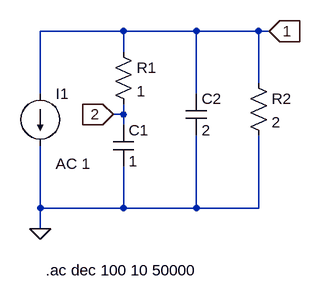
[diagram p0: schematic Lipshitz_c.asc]
Lipshitz_c.asc, the LTspice schematic file:
Version 4
SHEET 1 880 680
WIRE 32 -16 -96 -16
WIRE 144 -16 32 -16
WIRE 240 -16 144 -16
WIRE 256 -16 240 -16
WIRE 32 16 32 -16
WIRE 240 64 240 -16
WIRE -96 80 -96 -16
WIRE 144 80 144 -16
WIRE 32 112 32 96
WIRE 32 112 16 112
WIRE 32 128 32 112
WIRE -96 256 -96 160
WIRE 32 256 32 192
WIRE 32 256 -96 256
WIRE 144 256 144 144
WIRE 144 256 32 256
WIRE 240 256 240 144
WIRE 240 256 144 256
WIRE -96 288 -96 256
FLAG -96 288 0
FLAG 256 -16 1
IOPIN 256 -16 In
FLAG 16 112 2
IOPIN 16 112 In
SYMBOL cap 16 128 R0
SYMATTR InstName C1
SYMATTR Value 1
SYMBOL res 16 0 R0
SYMATTR InstName R1
SYMATTR Value 1
SYMBOL res 224 48 R0
SYMATTR InstName R2
SYMATTR Value 2
SYMBOL cap 128 80 R0
SYMATTR InstName C2
SYMATTR Value 2
SYMBOL current -96 80 R0
WINDOW 123 24 108 Left 2
WINDOW 39 0 0 Left 0
SYMATTR Value2 AC 1
SYMATTR InstName I1
SYMATTR Value ""
TEXT -88 352 Left 2 !.ac dec 100 10 50000

The netlist it stands for:
* Lipshitz_c.asc
C1 2 0 1
R1 1 2 1
R2 1 0 2
C2 1 0 2
I1 1 0 AC 1
.ac dec 100 10 50000
.backanno
.end